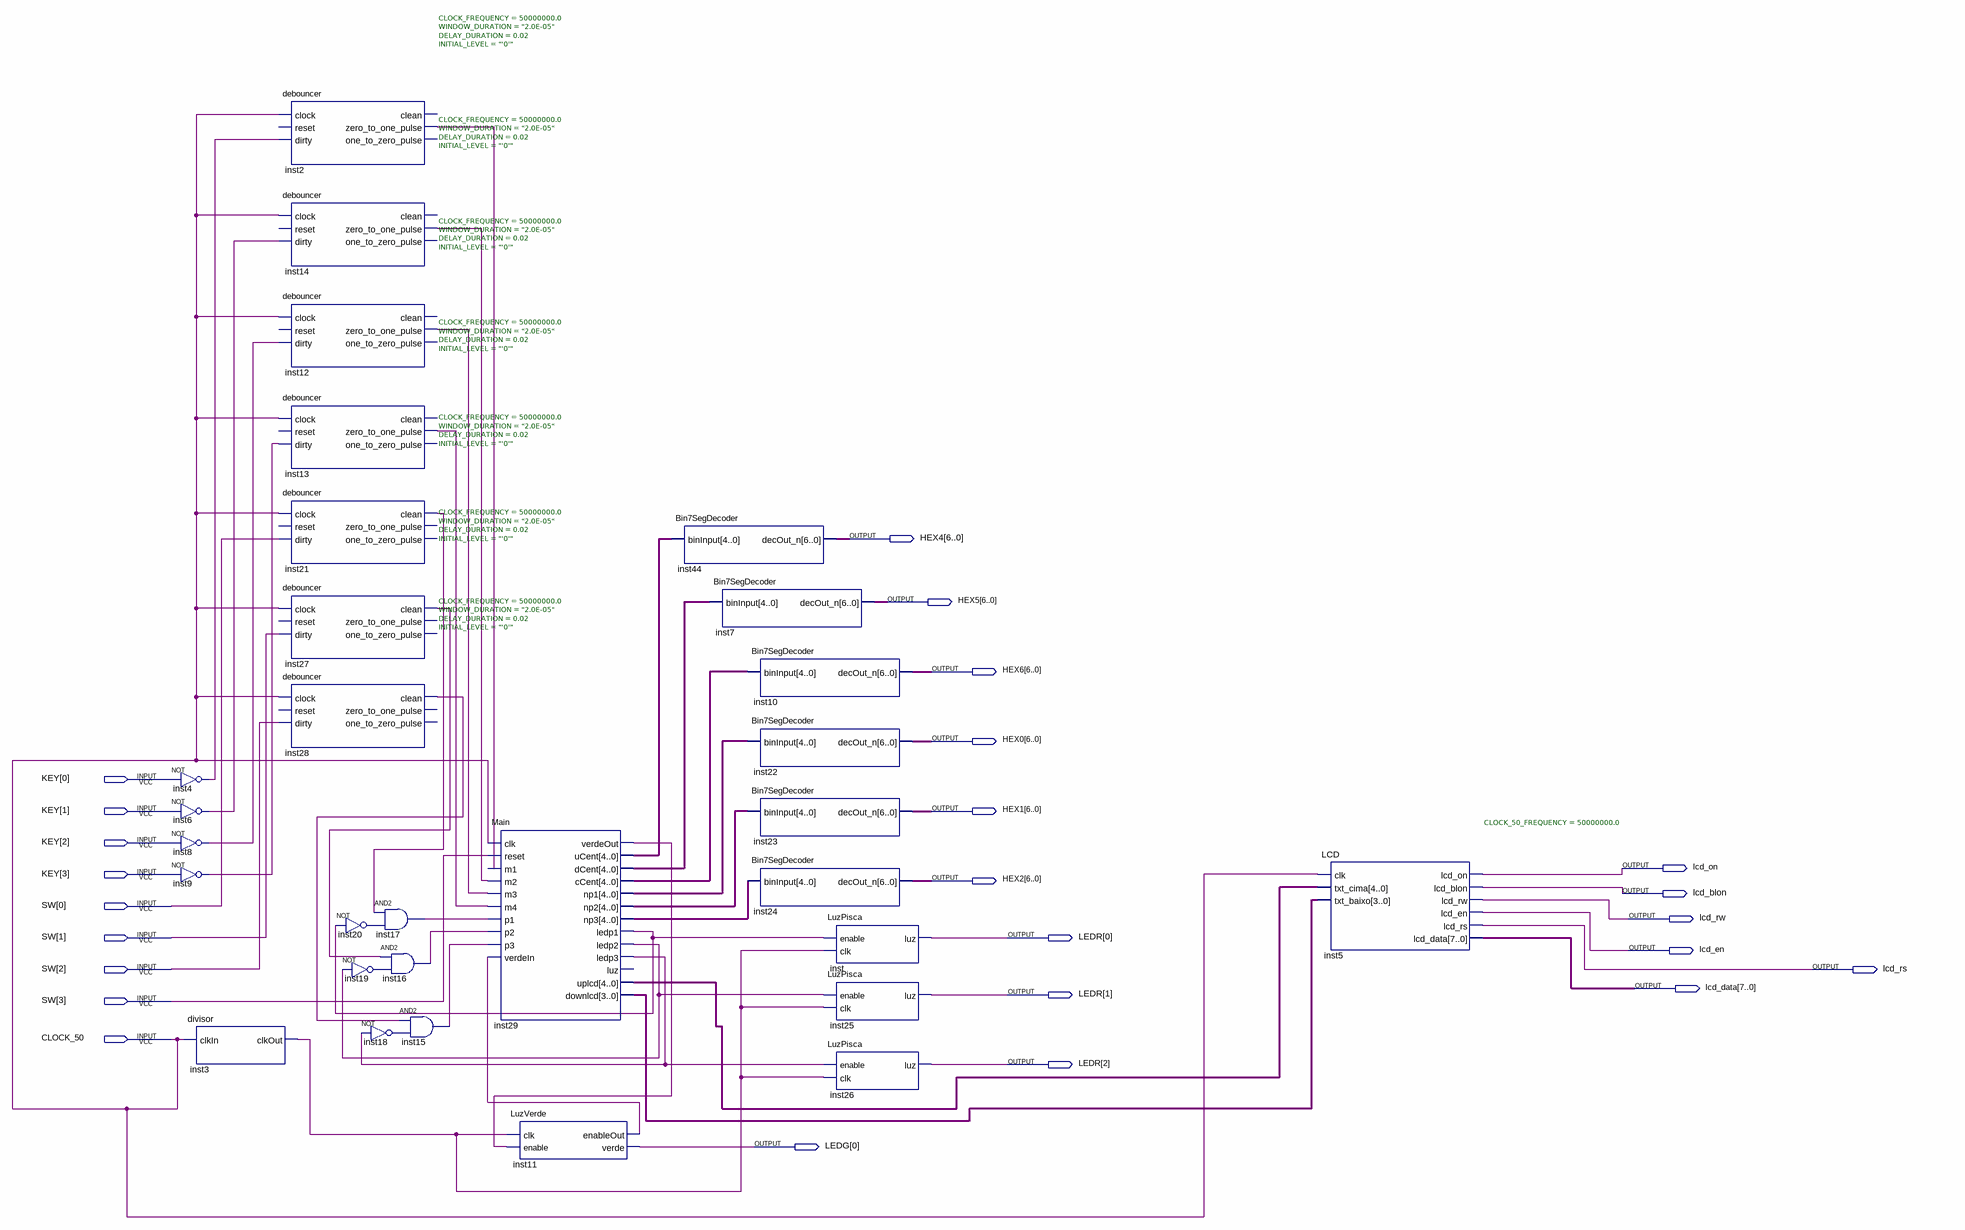
[diagram p0: schematic sheet]
// Quartus schematic blocos.bdf as structural Verilog: 30 symbols, 25 pins
module blocos (
  input  [3:0] KEY,
  input  [3:0] SW,
  input  CLOCK_50,
  output [6:0] HEX4,
  output [6:0] HEX5,
  output [6:0] HEX6,
  output [6:0] HEX0,
  output [6:0] HEX1,
  output lcd_on,
  output [6:0] HEX2,
  output lcd_blon,
  output lcd_rw,
  output [2:0] LEDR,
  output lcd_en,
  output lcd_rs,
  output [7:0] lcd_data,
  output [0:0] LEDG
);

  wire inst2_zero_to_one_pulse, inst3_clkout, inst4_out, inst6_out, inst8_out, inst9_out, inst11_enableout,
       inst12_zero_to_one_pulse, inst13_zero_to_one_pulse, inst14_zero_to_one_pulse, inst15_out, inst16_out,
       inst17_out, inst18_out, inst19_out, inst20_out, inst21_clean, inst27_clean, inst28_clean,
       inst29_ledp1, inst29_ledp2, inst29_ledp3, inst29_verdeout;
  wire [3:0] inst29_downlcd;
  wire [4:0] inst29_ccent, inst29_dcent, inst29_np1, inst29_np2, inst29_np3, inst29_ucent, inst29_uplcd;

  not inst4 (inst4_out, KEY[0]);
  not inst6 (inst6_out, KEY[1]);
  not inst8 (inst8_out, KEY[2]);
  not inst9 (inst9_out, KEY[3]);
  divisor inst3 (.clkIn(CLOCK_50), .clkOut(inst3_clkout));
  debouncer #(.CLOCK_FREQUENCY(50000000.0), .WINDOW_DURATION("2.0E-05"), .DELAY_DURATION(0.02), .INITIAL_LEVEL("'0'")) inst2 (
    .clock(CLOCK_50), .dirty(inst4_out), .zero_to_one_pulse(inst2_zero_to_one_pulse));  // open: reset, clean, one_to_zero_pulse
  debouncer #(.CLOCK_FREQUENCY(50000000.0), .WINDOW_DURATION("2.0E-05"), .DELAY_DURATION(0.02), .INITIAL_LEVEL("'0'")) inst14 (
    .clock(CLOCK_50), .dirty(inst6_out), .zero_to_one_pulse(inst14_zero_to_one_pulse));  // open: reset, clean, one_to_zero_pulse
  debouncer #(.CLOCK_FREQUENCY(50000000.0), .WINDOW_DURATION("2.0E-05"), .DELAY_DURATION(0.02), .INITIAL_LEVEL("'0'")) inst12 (
    .clock(CLOCK_50), .dirty(inst8_out), .zero_to_one_pulse(inst12_zero_to_one_pulse));  // open: reset, clean, one_to_zero_pulse
  debouncer #(.CLOCK_FREQUENCY(50000000.0), .WINDOW_DURATION("2.0E-05"), .DELAY_DURATION(0.02), .INITIAL_LEVEL("'0'")) inst13 (
    .clock(CLOCK_50), .dirty(inst9_out), .zero_to_one_pulse(inst13_zero_to_one_pulse));  // open: reset, clean, one_to_zero_pulse
  debouncer #(.CLOCK_FREQUENCY(50000000.0), .WINDOW_DURATION("2.0E-05"), .DELAY_DURATION(0.02), .INITIAL_LEVEL("'0'")) inst21 (
    .clock(CLOCK_50), .dirty(SW[0]), .clean(inst21_clean));  // open: reset, zero_to_one_pulse, one_to_zero_pulse
  debouncer #(.CLOCK_FREQUENCY(50000000.0), .WINDOW_DURATION("2.0E-05"), .DELAY_DURATION(0.02), .INITIAL_LEVEL("'0'")) inst27 (
    .clock(CLOCK_50), .dirty(SW[1]), .clean(inst27_clean));  // open: reset, zero_to_one_pulse, one_to_zero_pulse
  debouncer #(.CLOCK_FREQUENCY(50000000.0), .WINDOW_DURATION("2.0E-05"), .DELAY_DURATION(0.02), .INITIAL_LEVEL("'0'")) inst28 (
    .clock(CLOCK_50), .dirty(SW[2]), .clean(inst28_clean));  // open: reset, zero_to_one_pulse, one_to_zero_pulse
  and inst17 (inst17_out, inst21_clean, inst20_out);
  not inst20 (inst20_out, inst29_ledp1);
  not inst19 (inst19_out, inst29_ledp2);
  not inst18 (inst18_out, inst29_ledp3);
  and inst16 (inst16_out, inst27_clean, inst19_out);
  and inst15 (inst15_out, inst28_clean, inst18_out);
  Main inst29 (
    .clk(CLOCK_50), .reset(SW[3]), .m1(inst2_zero_to_one_pulse), .m2(inst14_zero_to_one_pulse),
    .m3(inst12_zero_to_one_pulse), .m4(inst13_zero_to_one_pulse), .p1(inst17_out), .p2(inst16_out),
    .p3(inst15_out), .verdeIn(inst11_enableout), .verdeOut(inst29_verdeout), .uCent(inst29_ucent),
    .dCent(inst29_dcent), .cCent(inst29_ccent), .np1(inst29_np1), .np2(inst29_np2), .np3(inst29_np3),
    .ledp1(inst29_ledp1), .ledp2(inst29_ledp2), .ledp3(inst29_ledp3), .uplcd(inst29_uplcd),
    .downlcd(inst29_downlcd));  // open: luz
  LuzVerde inst11 (.clk(inst3_clkout), .enable(inst29_verdeout), .enableOut(inst11_enableout), .verde(LEDG[0]));
  Bin7SegDecoder inst44 (.binInput(inst29_ucent), .decOut_n(HEX4));
  Bin7SegDecoder inst7 (.binInput(inst29_dcent), .decOut_n(HEX5));
  Bin7SegDecoder inst10 (.binInput(inst29_ccent), .decOut_n(HEX6));
  Bin7SegDecoder inst22 (.binInput(inst29_np1), .decOut_n(HEX0));
  Bin7SegDecoder inst23 (.binInput(inst29_np2), .decOut_n(HEX1));
  Bin7SegDecoder inst24 (.binInput(inst29_np3), .decOut_n(HEX2));
  LuzPisca inst (.enable(inst29_ledp1), .clk(inst3_clkout), .luz(LEDR[0]));
  LuzPisca inst25 (.enable(inst29_ledp2), .clk(inst3_clkout), .luz(LEDR[1]));
  LuzPisca inst26 (.enable(inst29_ledp3), .clk(inst3_clkout), .luz(LEDR[2]));
  LCD #(.CLOCK_50_FREQUENCY(50000000.0)) inst5 (
    .clk(CLOCK_50), .txt_cima(inst29_uplcd), .txt_baixo(inst29_downlcd), .lcd_on(lcd_on),
    .lcd_blon(lcd_blon), .lcd_rw(lcd_rw), .lcd_en(lcd_en), .lcd_rs(lcd_rs), .lcd_data(lcd_data));
endmodule
